# EAGLE design locker_unit (EAGLE 7.2.0)
CNAME: Locker unit; CREVISION: 0.2; DESIGNER: Rud Wangrungarun
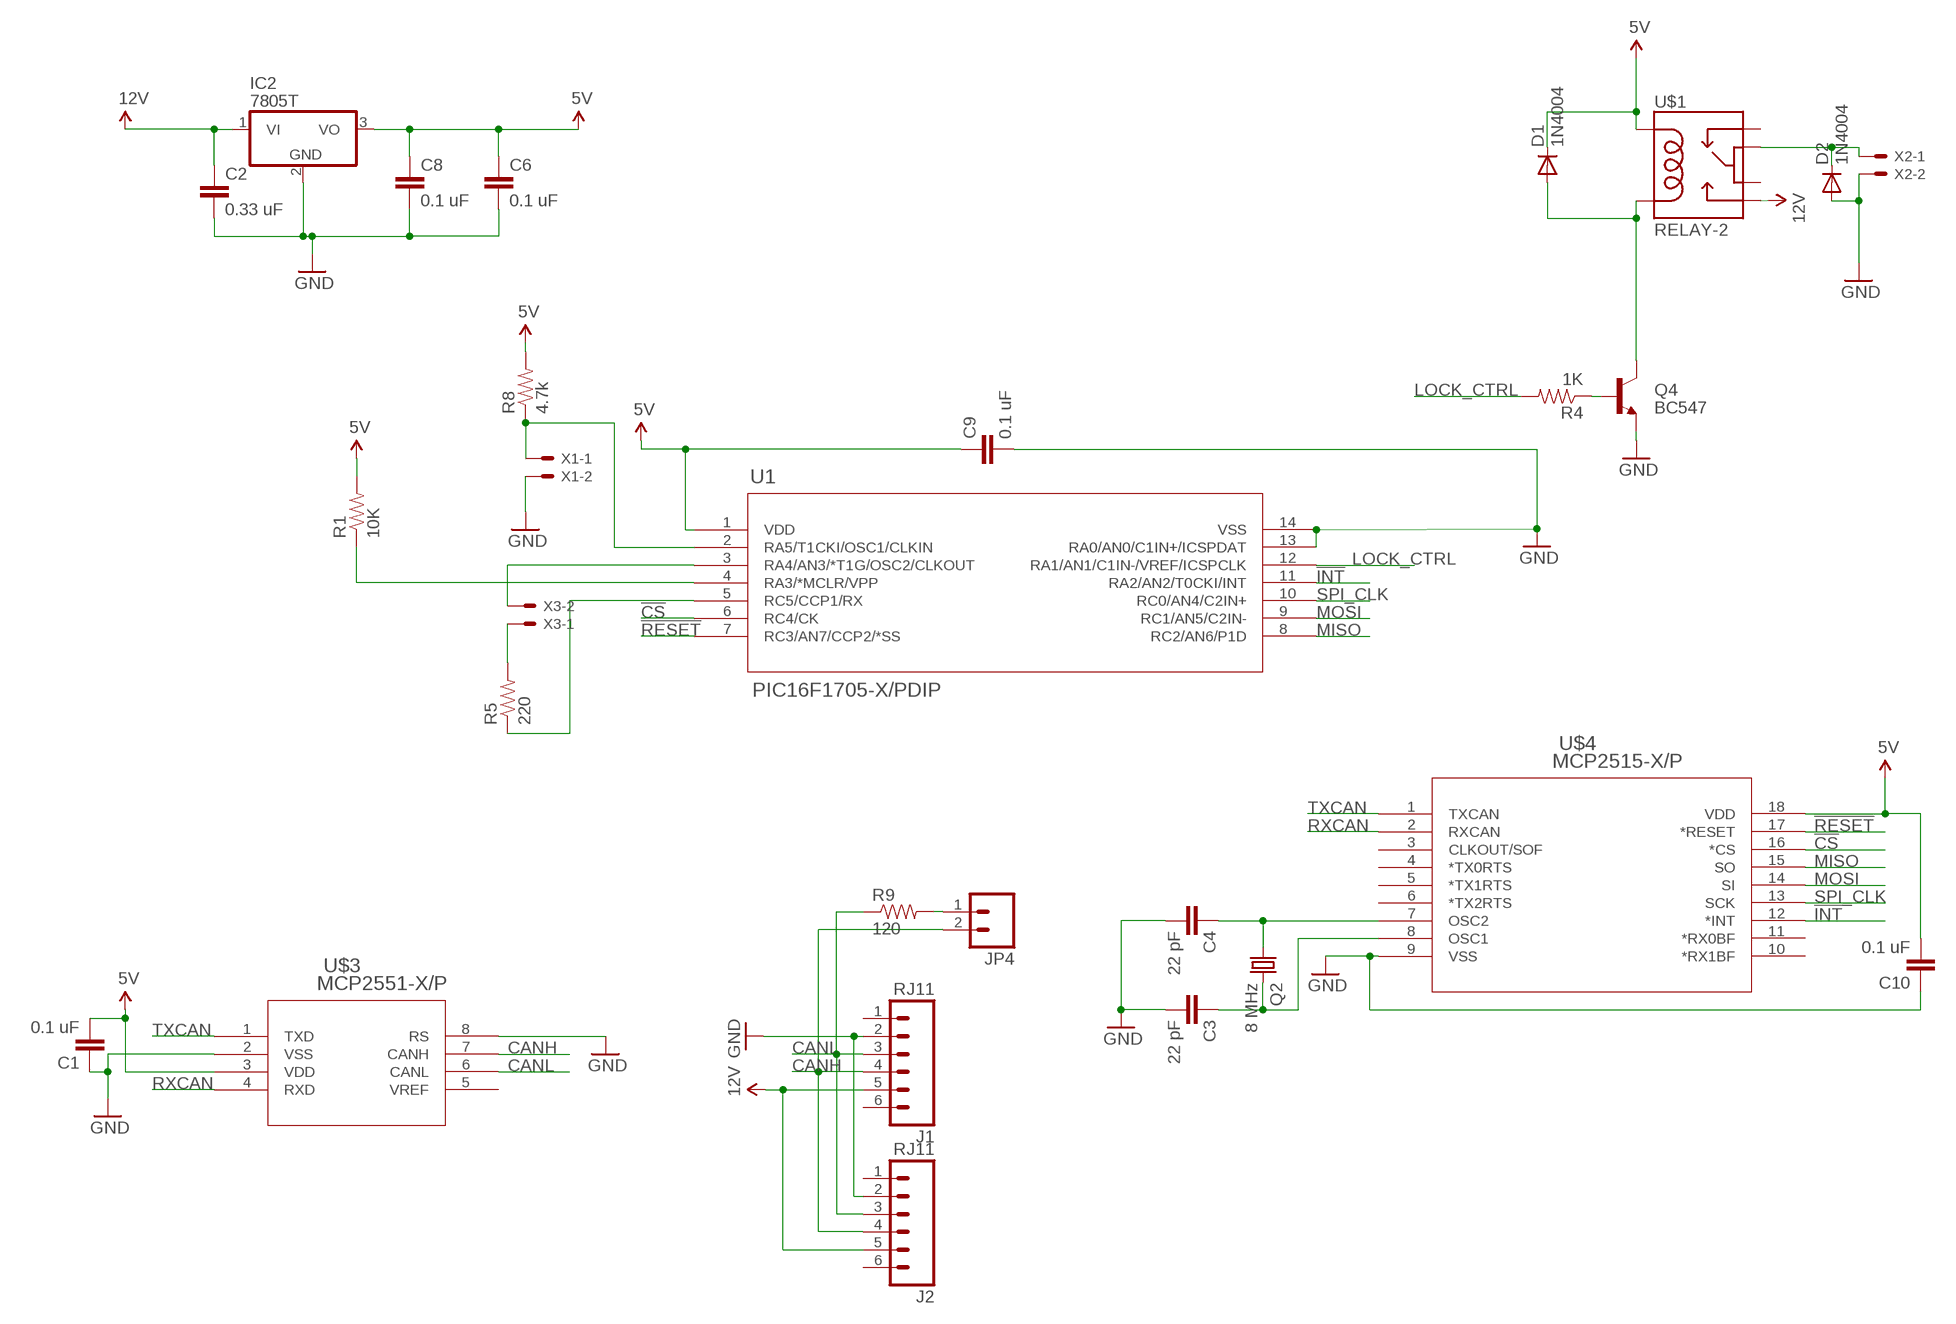
[diagram p0: schematic, sheet 1]

## Parts
C1  0.1 uF  C-EU050-030X075  [C050-030X075]
C2  0.33 uF  C-EU050-030X075  [C050-030X075]
C3  22 pF  C-EU025-025X050  [C025-025X050]
C4  22 pF  C-EU025-025X050  [C025-025X050]
C6  0.1 uF  C-EU050-030X075  [C050-030X075]
C8  0.1 uF  C-EU050-030X075  [C050-030X075]
C9  0.1 uF  C-EU050-030X075  [C050-030X075]
C10  0.1 uF  C-EU050-030X075  [C050-030X075]
D1  1N4004  [DO41-10]
D2  1N4004  [DO41-10]
IC2  7805T  [TO220H]
J1  RJ11  RJ11-6PTH  [RJ11-6]
J2  RJ11  RJ11-6PTH  [RJ11-6]
JP4  M02PTH  [1X02]
Q2  8 MHz  CRYSTALHC49US  [HC49US]
Q4  BC547  TRANSISTOR_NPNBC547  [TO-92-AMMO]
R1  10K  RESISTORAXIAL-0.3  [AXIAL-0.3]
R4  1K  RESISTORAXIAL-0.3  [AXIAL-0.3]
R5  220  RESISTORAXIAL-0.3  [AXIAL-0.3]
R8  4.7k  RESISTORAXIAL-0.3  [AXIAL-0.3]
R9  120  RESISTORAXIAL-0.3  [AXIAL-0.3]
U1  PIC16F1705-X/PDIP  [PDIP14_300MC]
U$1  RELAY-2  [RELAY-SY]
U$3  MCP2551-X/P  [PDIP8_300MC]
U$4  MCP2515-X/P  [PDIP18_300MC]
X1  KK-156-2  [KK-156-2]
X2  KK-156-2  [KK-156-2]
X3  KK-156-2  [KK-156-2]

## Nets
5V: C1.2 C6.1 C8.1 C9.1 C10.2 D1.C IC2.3(VO) R1.P$2 R8.P$2 U1.1(VDD) U$1.2 U$3.3(VDD) U$4.18(VDD)
12V: C2.1 IC2.1(VI) J1.5 J2.5 U$1.10
!CS: U1.6(RC4/CK) U$4.16(*CS)
!INT: U1.11(RA2/AN2/T0CKI/INT) U$4.12(*INT)
!RESET: U1.7(RC3/AN7/CCP2/*SS) U$4.17(*RESET)
CANH: J1.4 J2.4 JP4.2 U$3.7(CANH)
CANL: J1.3 J2.3 R9.P$1 U$3.6(CANL)
GND: C1.1 C2.2 C3.2 C4.2 C6.2 C8.2 C9.2 C10.1 D2.A IC2.2(GND) J1.2 J2.2 Q4.3(E) U1.13(RA0/AN0/C1IN+/ICSPDAT) U1.14(VSS) U$3.2(VSS) U$3.8(RS) U$4.9(VSS) X1.2 X2.2
LOCK_CTRL: R4.P$2 U1.12(RA1/AN1/C1IN-/VREF/ICSPCLK)
MISO: U1.8(RC2/AN6/P1D) U$4.15(SO)
MOSI: U1.9(RC1/AN5/C2IN-) U$4.14(SI)
N$1: D2.C U$1.5 X2.1
N$2: R5.P$1 U1.5(RC5/CCP1/RX)
N$3: D1.A Q4.1(C) U$1.9
N$4: Q4.2(B) R4.P$1
N$5: R5.P$2 X3.1
N$6: R1.P$1 U1.4(RA3/*MCLR/VPP)
N$10: C3.1 Q2.2 U$4.8(OSC1)
N$11: C4.1 Q2.1 U$4.7(OSC2)
N$12: U1.3(RA4/AN3/*T1G/OSC2/CLKOUT) X3.2
N$16: R8.P$1 U1.2(RA5/T1CKI/OSC1/CLKIN) X1.1
N$17: JP4.1 R9.P$2
RXCAN: U$3.4(RXD) U$4.2(RXCAN)
SPI_CLK: U1.10(RC0/AN4/C2IN+) U$4.13(SCK)
TXCAN: U$3.1(TXD) U$4.1(TXCAN)
Unconnected: J1.1 J1.6 J2.1 J2.6 U$1.1 U$1.6 U$3.5(VREF) U$4.3(CLKOUT/SOF) U$4.4(*TX0RTS) U$4.5(*TX1RTS) U$4.6(*TX2RTS) U$4.10(*RX1BF) U$4.11(*RX0BF)

## Library data of the parts
C1-C4 C6 C8-C10 = rcl:C-EU: CAPACITOR, European symbol
D1 D2 = diode:1N4004: DIODE general purpose rectifier, 1 A
IC2 = linear:78*: Positive VOLTAGE REGULATOR Source: http://cache.national.com/ds/LM/LM78L05.pdf http://www.fairchildsemi.com/ds/LM/LM7805.pdf
J1 J2 = SparkFun-Connectors:RJ11-6: RJ11 Jack Simple 6 pin RJ11 jack. Commonly found on CAT3 devices and Microchip programmers. SKU: PRT-00132; PROD_ID: CONN-08590
JP4 = SparkFun-Connectors:M02: Standard 2-pin 0.1" header. Use with - straight break away headers ( PRT-00116) - right angle break away headers (PRT-00553) - swiss pins (PRT-00743) - machine pins (PRT-00117) - female headers (PRT-00115) Molex polarized connector foot print use with: PRT-08233 with associated crimp pins and housings. 2.54_SCREWTERM for use with PRT-10571. 3.5mm Screw Terminal footprints for PRT-08084 5mm Screw Terminal footprints for use with PRT-08432
Q2 = SparkFun-FreqCtrl:CRYSTAL: Various standard crystals. Proven footprints.
Q4 = SparkFun-DiscreteSemi:TRANSISTOR_NPN: Generic NPN BJT MMBT2222A - TRANS-08049 (SOT-23, 1A 40V) MPSA42 - TRANS-09116 (SOT-23, 500mA 300V) MMBT5088LT1G - TRANS-11160 (SOT-23, 50 mA 30V) BC547 - COM-08928 <http://www.sparkfun.com/products/8928> (TO-92 45V 100mA) (1.Collector 2.Base 3.Emitter) 2N3904 - COM-00521 <http://www.sparkfun.com/products/521> (TO-92 40V 200mA) (1.Emitter 2.Base 3.Collector) P2N2222A - COM-12852 <http://www.sparkfun.com/products/12852> (TO-92 40V 600mA) (1.Collector 2.Base 3.Emitter)
R1 R4 R5 R8 R9 = SparkFun-Passives:RESISTOR: Resistor Basic schematic elements and footprints for 0603, 1206, and PTH resistors.
U1 = Locker-custom:PIC16F1705-X/P
U$1 = Locker-custom:RELAY-2: SPDT relay (COM-00100)
U$3 = Locker-custom:MCP2551-X/P
U$4 = Locker-custom:MCP2515-X/P
X1-X3 = Locker-custom:KK-156-2: KK 156 HEADER Source: http://www.molex.com/pdm_docs/sd/026604100_sd.pdf; OC_FARNELL: unknown; OC_NEWARK: unknown

## Board
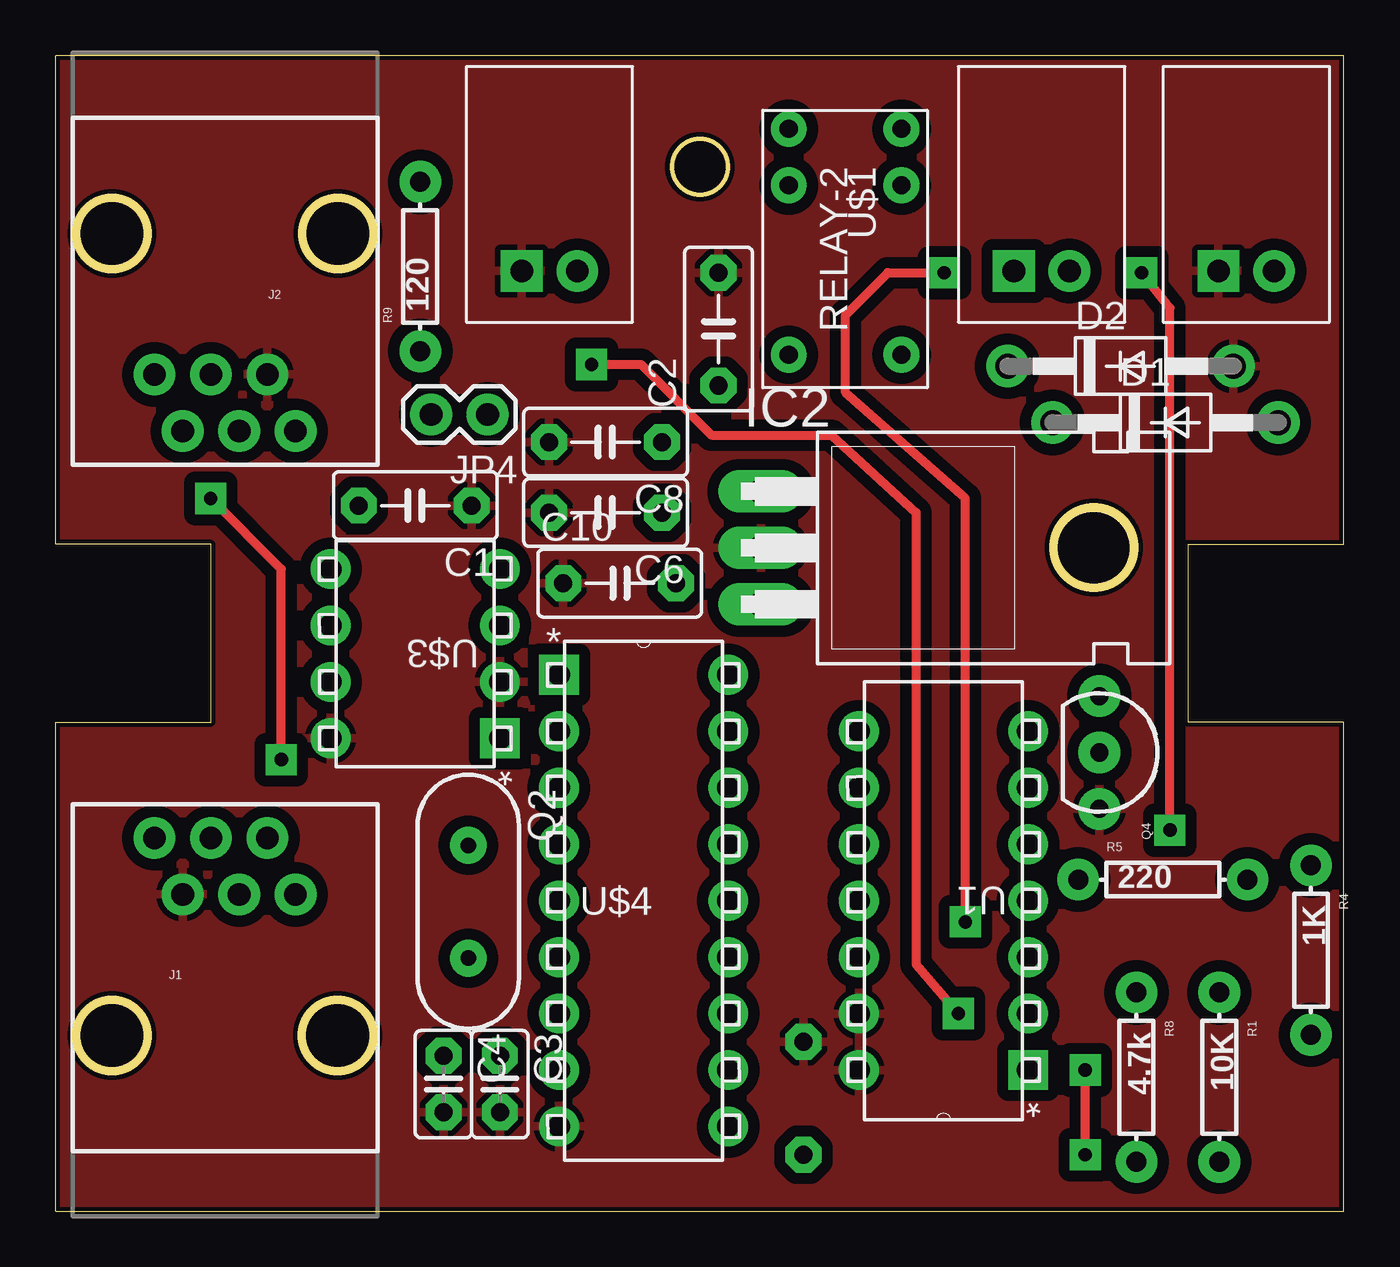
[diagram p1: board, top side]
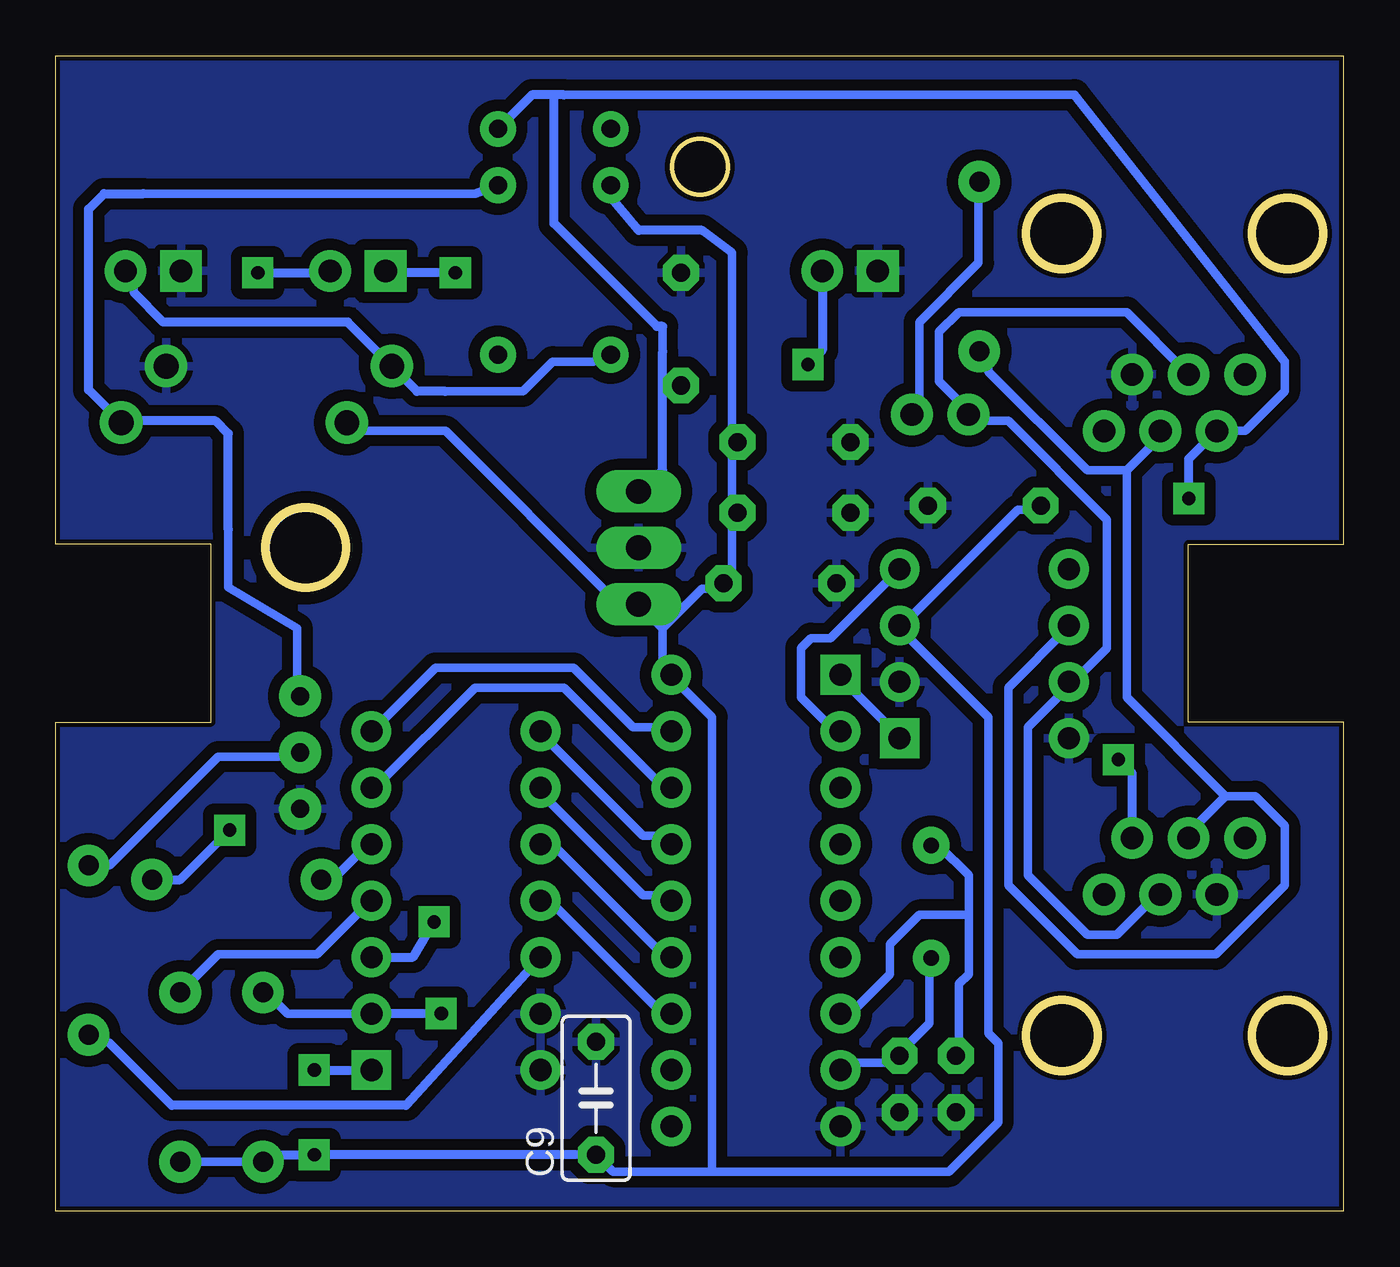
[diagram p2: board, bottom side, seen from below]

Size 58 x 52 mm. Coordinates in mm from the lower left corner, seen from the top.
Outline: 0,0 58,0 58,22 51,22 51,30 58,30 58,52 0,52 0,30 7,30 7,22 0,22 0,0
Outline: circle at 2.54,7.9 radius 1.6
Outline: circle at 12.7,7.9 radius 1.6
Outline: circle at 12.71,44 radius 1.6
Outline: circle at 2.55,44 radius 1.6
Outline: circle at 29,47 radius 1.25
Outline: circle at 46.74,29.87 radius 1.8
Copper layers (1*16): Top 0.035mm / dielectric 1.5mm / Bottom 0.035mm
Design rules "x1": minimum track width 15mil, minimum drill 32mil, track to track 20mil, track to pad 20mil, pad to pad 20mil, via to via 8mil, smd to smd 8mil, copper to edge 8mil, drill to drill 8mil, minimum pad ring 0.4mm, minimum via ring 0.4mm, stop-mask expansion 4mil, vias tented up to drill 20mil, thermal gap 10mil
Holes 2.5 mm at 29,47

### Footprints (pad centres in the part's own frame; a part is rotated, then mirrored left to right if it is on the bottom)
C050-030X075 = drill 0.813 octagon: 1 -2.54,0; 2 2.54,0
C025-025X050 = drill 0.813 octagon: 1 -1.27,0; 2 1.27,0
DO41-10 = drill 1.118: A 5.08,0; C -5.08,0
TO220H = drill 1.118 long: 1 -2.54,-10.16; 2 0,-10.16; 3 2.54,-10.16 | hole 3.302: 0,4.826
RJ11-6 = drill 1.016 pad 1.88: 1 -3.175,8.89; 2 -1.905,6.35; 3 -0.635,8.89; 4 0.635,6.35; 5 1.905,8.89; 6 3.175,6.35 | hole 3.251: -5.08,0; 5.08,0
1X02 = drill 1.02 pad 1.88: 1 0,0; 2 2.54,0
HC49US = drill 0.7 pad 1.651: 1 -2.54,0; 2 2.54,0
TO-92-AMMO = drill 0.813 pad 1.88: 1 -2.54,0; 2 0,0; 3 2.54,0
AXIAL-0.3 = drill 0.9 pad 1.88: P$1 -3.81,0; P$2 3.81,0
PDIP14_300MC = drill 0.991 square: 1 -7.62,15.24 | drill 0.991: 2 -7.62,12.7; 3 -7.62,10.16; 4 -7.62,7.62; 5 -7.62,5.08; 6 -7.62,2.54; 7 -7.62,0; 8 0,0; 9 0,2.54; 10 0,5.08; 11 0,7.62; 12 0,10.16; 13 0,12.7; 14 0,15.24
RELAY-SY = drill 0.813: 1 0.85,1.16; 2 3.39,1.16; 5 11.01,1.16; 6 11.01,6.24; 9 3.39,6.24; 10 0.85,6.24
PDIP8_300MC = drill 0.991 square: 1 -7.62,7.62 | drill 0.991: 2 -7.62,5.08; 3 -7.62,2.54; 4 -7.62,0; 5 0,0; 6 0,2.54; 7 0,5.08; 8 0,7.62
PDIP18_300MC = drill 0.991 square: 1 -7.62,20.32 | drill 0.991: 2 -7.62,17.78; 3 -7.62,15.24; 4 -7.62,12.7; 5 -7.62,10.16; 6 -7.62,7.62; 7 -7.62,5.08; 8 -7.62,2.54; 9 -7.62,0; 10 0,0; 11 0,2.54; 12 0,5.08; 13 0,7.62; 14 0,10.16; 15 0,12.7; 16 0,15.24; 17 0,17.78; 18 0,20.32
KK-156-2 = drill 1.016 pad 1.88: 1 5,2.3 | drill 1.016 pad 1.88 square: 2 2.5,2.3

### Placement (x,y rotation side)
C1  16.19,31.75 180 top
C2  29.84,39.69 90 top
C3  20,5.71 270 top
C4  17.46,5.71 270 top
C6  24.76,31.43 180 top
C8  24.76,34.61 180 top
C9  33.66,5.08 90 bottom
C10  25.39,28.26 0 top
D1  49.96,35.48 0 top
D2  47.94,38.02 0 top
IC2  41.91,29.84 270 top
J1  7.63,7.9 0 top
J2  7.63,44 180 top
JP4  19.45,35.85 180 top
Q2  18.58,13.92 270 top
Q4  46.99,20.64 270 top
R1  52.39,6.03 270 top
R4  56.52,11.75 270 top
R5  49.85,14.92 0 top
R8  48.66,6.03 270 top
R9  16.42,42.51 90 top
U1  36.16,21.59 180 top
U$1  31.84,49.55 270 top
U$3  12.38,28.89 180 top
U$4  30.28,3.81 0 top
X1  18.48,40.01 0 top
X2  49.85,40.01 0 top
X3  40.64,40.01 0 top

### Tracks (layer width: path | path; a pad name or v marks a point on that pad's centre or on a via)
5V  (via drill 0.6)
  Top 0.406: v46.35,2.54 v46.35,6.35
  Bottom 0.381: 27.56,43.12 27.56,34.67 C8.1 27.56,34.23 27.56,31.56 C6.1 27.56,31.11 27.56,28.45 C10.2 28,28 28.89,28 30.67,26.23 | 33.34,45.78 U$1.2 | 30.67,26.23 30.67,24.45 U$4.18 30.23,24 28.45,22.23 28.45,1.78 | 30.67,26.23 IC2.3 32,27.56 32.89,27.56 40.45,35.12 44.45,35.12 D1.C | 20,26.23 14.67,31.56 13.78,31.56 C1.2 | R8.P$2 R1.P$2 | 20,26.23 16,22.23 16,8 15.56,7.56 15.56,4 17.78,1.78 28.45,1.78 | 28.45,1.78 32.89,1.78 33.34,2.22 C9.1 | 20,26.23 U$3.3
  Bottom 0.406: 27.56,43.12 28.89,44.13 31.75,44.13 33.46,46.16 U$1.2 | R8.P$2 48.34,2.54 v46.35,2.54 C9.1 | v46.35,6.35 U1.1
12V  (via drill 0.6)
  Top 0.406: v10.16,20.32 10.16,28.89 v6.99,32.07
  Bottom 0.381: 30.67,33.34 31.56,32.45 IC2.1 | 30.67,38.67 30.67,39.81 | 2.67,38.23 2.67,36.89 4.45,35.12 5.33,35.12 J2.5 | 35.12,50.23 12.13,50.23
  Bottom 0.406: J1.5 9.54,19.7 v10.16,20.32 | v6.99,32.07 6.99,33.85 J2.5 | 30.67,33.34 30.67,36.83 | 30.67,36.83 30.67,38.67 | C2.1 30.35,37.15 30.67,36.83 | 2.67,38.23 12.13,50.23 | 35.12,50.23 35.56,50.23 | 35.56,50.23 36.55,50.23 U$1.10 | 30.67,39.81 30.92,39.81 35.56,44.45 35.56,50.23
!CS
  Bottom 0.381: U$4.16 30.67,19.11 35.12,23.56 39.12,23.56 43.56,19.11 U1.6
!INT
  Bottom 0.381: U$4.12 30.67,8.89 36.01,14.22 U1.11
!RESET
  Bottom 0.381: U$4.17 30.67,21.78 32,21.78 34.67,24.45 40.89,24.45 43.56,21.78 U1.7
CANH
  Bottom 0.381: J2.4 7.11,37.78 9.78,40.45 17.34,40.45 18.22,39.56 18.22,37.34 16.89,36.01 JP4.2 16.89,35.56 15.11,35.56 10.67,31.11 10.67,25.34 12,24 U$3.7 12.45,23.56 14.22,21.78 14.22,15.11 11.56,12.45 10.22,12.45 8.45,14.22 J1.4
CANL
  Bottom 0.381: 9.78,33.34 8.45,34.67 J2.3 | 9.78,33.34 11.56,33.34 16,37.78 16,38.67 R9.P$1 | 5.33,18.67 4,18.67 2.67,17.34 2.67,14.67 5.78,11.56 12,11.56 15.11,14.67 15.11,23.56 12.45,26.23 U$3.6 | 5.33,18.67 7.11,16.89 J1.3 | 9.78,33.34 9.78,23.11 5.33,18.67
GND
  Bottom 0.381: 36.1,8.83 36.01,8.89 U1.13 36.01,8.45 36.1,8.45
  pour Bottom (isolate 0): 0,0 0,22 7,22 7,30 0,30 0,52 58,52 58,30 51,30 51,22 58,22 58,0
  pour Top (isolate 0): 0,0 0,22 7,22 7,30 0,30 0,52 58,52 58,30 51,30 51,22 58,22 58,0
LOCK_CTRL
  Bottom 0.381: 55.56,7.56 R4.P$2
  Bottom 0.406: 55.56,7.56 52.77,4.76 42.23,4.76 U1.12
MISO
  Bottom 0.381: U$4.15 30.67,16.89 31.56,16.89 36.01,21.34 U1.8
MOSI
  Bottom 0.381: U$4.14 30.67,14.22 31.56,14.22 36.01,18.67 U1.9
N$1
  Bottom 0.381: 40.45,36.89 36.96,36.89 35.62,38.23 33.78,38.23 U$1.5 | 53.15,40.01 54.48,41.34 54.48,42.23 X2.1
  Bottom 0.406: 40.45,36.89 41.73,36.89 D2.C 44.84,40.01 53.15,40.01
N$2
  Bottom 0.381: U1.5 44.01,16.45 45.78,14.67 R5.P$1
N$3
  Bottom 0.381: 54.04,45.78 39.12,45.78 U$1.9 | 55.12,35.56 D1.A | 50.23,30.67 50.23,28.07 47.12,26.23 47.12,23.56 Q4.1
  Bottom 0.406: 50.23,30.67 50.23,34.99 50.8,35.56 54.97,35.56 D1.A | 55.12,35.56 56.52,36.96 56.52,45.09 55.82,45.78 54.04,45.78
N$4
  Bottom 0.381: R4.P$1 55.56,15.56 50.67,20.45 47.12,20.45 Q4.2
N$5  (via drill 0.6)
  Top 0.406: v50.16,17.14 50.16,40.64 v48.9,42.23
  Bottom 0.406: R5.P$2 52.39,14.92 v50.16,17.14 | v48.9,42.23 45.4,42.23 X3.1
N$6
  Bottom 0.381: R1.P$1 50.67,11.56 46.23,11.56 44.01,13.78 U1.4
N$10
  Bottom 0.381: U$4.8 22.23,6.67 20,6.67 C3.1 20,7.11 18.67,8.45 18.67,11.11 Q2.2
N$11
  Bottom 0.381: 16.89,13.34 16.89,15.11 18.22,16.45 Q2.1 | 16.89,13.34 16.89,10.67 17.34,10.22 17.34,7.11 C4.1 | 16.89,13.34 19.11,13.34 20.45,12 20.45,10.67 22.23,8.89 U$4.7
N$12  (via drill 0.6)
  Top 0.406: v40.96,13.02 40.96,32.07 35.56,36.83 35.56,40.32 37.47,42.23 v40.01,42.23
  Bottom 0.406: U1.3 41.91,11.43 v40.96,13.02 | v40.01,42.23 42.74,42.23 X3.2
N$16  (via drill 0.6)
  Top 0.406: v24.13,38.1 26.35,38.1 29.53,34.92 34.92,34.92 38.73,31.43 38.73,11.11 v40.64,8.89
  Bottom 0.381: U1.2 47.56,8.89 48.45,9.78 R8.P$1
  Bottom 0.406: X1.1 23.48,38.75 v24.13,38.1 | v40.64,8.89 U1.2
N$17
  Bottom 0.381: R9.P$2 16.45,46.23 16.45,42.67 19.11,40.01 19.11,36.01 JP4.1
RXCAN
  Bottom 0.381: U$3.4 23.11,25.78 24,25.78 24.45,25.34 24.45,23.11 22.67,21.34 U$4.2
SPI_CLK
  Bottom 0.381: U$4.13 30.67,11.56 36.01,16.89 U1.10
TXCAN
  Bottom 0.381: U$3.1 20,21.34 22.67,24 U$4.1